# EAGLE design Audio Amplifier (EAGLE 9.1.2)
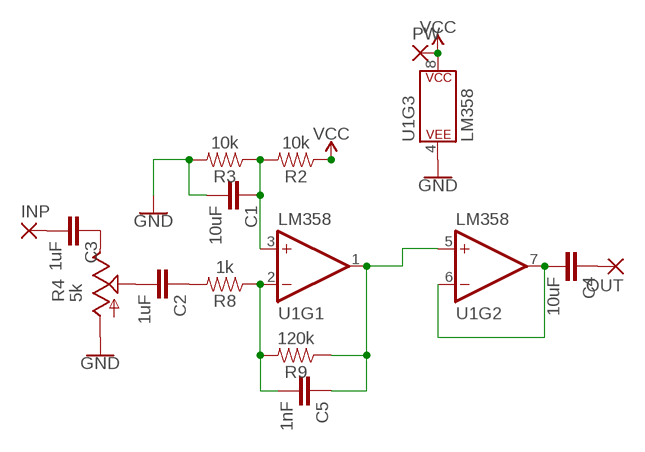
[diagram p0: schematic, sheet 1]

## Parts
C1  10uF  C5/3.5  [C5B3.5]
C2  1uF  C5/3.5  [C5B3.5]
C3  1uF  C5/3.5  [C5B3.5]
C4  10uF  C5/3.5  [C5B3.5]
C5  1nF  C5/3.5  [C5B3.5]
INP  2,54/1,1  [2,54/1,1]
OUT  2,54/1,1  [2,54/1,1]
PW  2,54/1,1  [2,54/1,1]
R2  10k  1KOHM-HORIZ-1/4W-1%  [AXIAL-0.3]
R3  10k  1KOHM-HORIZ-1/4W-1%  [AXIAL-0.3]
R4  5k  TRIM_US-B25V  [B25V]
R8  1k  1KOHM-HORIZ-1/4W-1%  [AXIAL-0.3]
R9  120k  1KOHM-HORIZ-1/4W-1%  [AXIAL-0.3]
U1  LM358  [DIP08]

## Nets
GND: C1.2 R3.P$2 R4.A U1.4(P$V-)
N$1: C1.1 R2.P$2 R3.P$1 U1.3(+IN)
N$2: C2.1 R8.P$2
N$3: C4.2 U1.6(-IN) U1.7(OUT)
N$4: C2.2 R4.S
N$5: C3.1 R4.E
N$6: C3.2 INP.1(P)
N$7: C5.2 R8.P$1 R9.P$2 U1.2(-IN)
N$9: C4.1 OUT.1(P)
N$12: C5.1 R9.P$1 U1.1(OUT) U1.5(+IN)
VCC: PW.1(P) R2.P$1 U1.8(P$V+)

## Library data of the parts
C1-C5 = capacitor-wima:C: CAPACITOR naming: grid - package width
INP OUT PW = wirepad:2,54/1,1: THROUGH-HOLE PAD
R2 R3 R9 = SparkFun-Resistors:1KOHM: 1kΩ resistor A resistor is a passive two-terminal electrical component that implements electrical resistance as a circuit element. Resistors act to reduce current flow, and, at the same time, act to lower voltage levels within circuits. - Wikipedia; PROD_ID: RES-12182; VALUE: 1k
R4 = pot:TRIM_US-: POTENTIOMETER
R8 = SparkFun-Resistors:1KOHM: 1kΩ resistor A resistor is a passive two-terminal electrical component that implements electrical resistance as a circuit element. Resistors act to reduce current flow, and, at the same time, act to lower voltage levels within circuits. - Wikipedia; PROD_ID: RES-12182
U1 = SparkFun-IC-Amplifiers:LM358: LM358 Jellybean op-amp Datasheet <http://www.sparkfun.com/datasheets/Components/General/LM358.pdf> SparkFun Products Op-Amp (Thru-Hole) - LM358 <https://www.sparkfun.com/products/9456> (COM-09456); PROD_ID: IC-09172

## Net classes
0 default: width 0.762 mm, drill 0.762 mm, clearance 0.508 mm

## Board
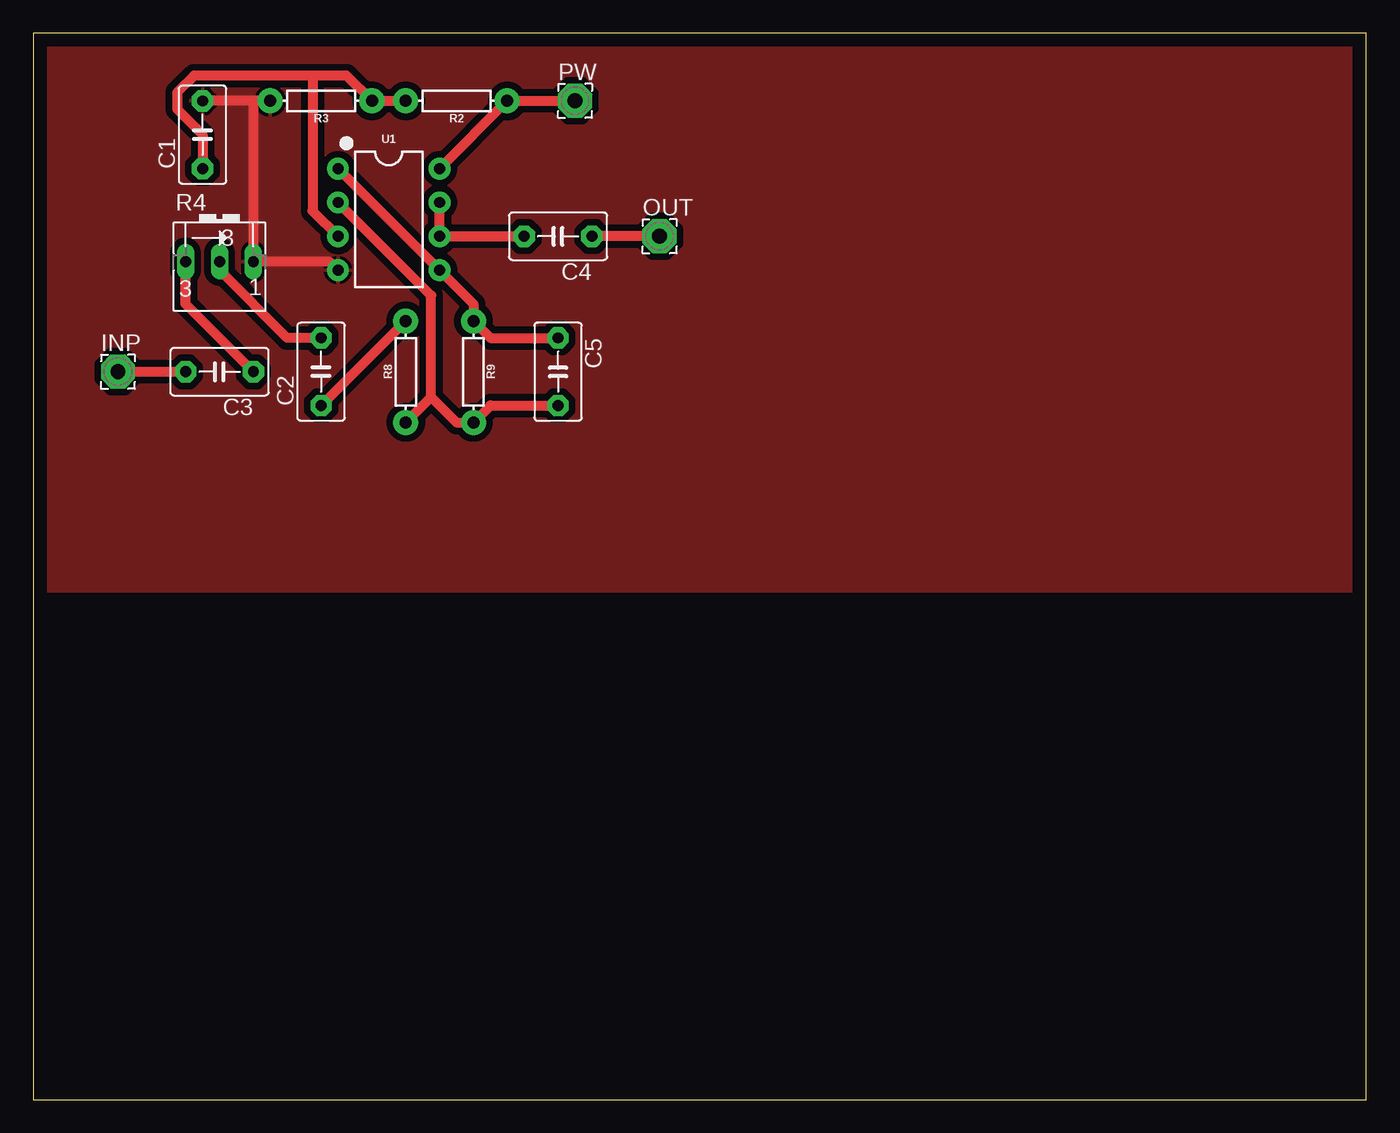
[diagram p1: board, top side]

Size 100 x 80 mm. Coordinates in mm from the lower left corner, seen from the top.
Outline: 0,0 100,0 100,80 0,80 0,0
Copper layers (1*16): Top 0.035mm / dielectric 1.5mm / Bottom 0.035mm
Design rules "default": minimum track width 6mil, minimum drill 0.35mm, track to track 6mil, track to pad 6mil, pad to pad 6mil, via to via 6mil, smd to smd 6mil, copper to edge 40mil, drill to drill 6mil, minimum pad ring 10mil, minimum via ring 8mil, stop-mask expansion 4mil, vias tented up to drill 0mil, thermal gap 10mil

### Footprints (pad centres in the part's own frame; a part is rotated, then mirrored left to right if it is on the bottom)
C5B3.5 = drill 0.813 pad 1.6 octagon: 1 -2.54,0; 2 2.54,0
2,54/1,1 = drill 1.118 pad 2.54 octagon: 1 0,0
AXIAL-0.3 = drill 0.9 pad 1.88: P$1 -3.81,0; P$2 3.81,0
B25V = drill 0.813 long: A 2.54,0.635; E -2.54,0.635; S 0,0.635
DIP08 = drill 0.813 pad 1.626: 1 -3.81,-3.81; 2 -1.27,-3.81; 3 1.27,-3.81; 4 3.81,-3.81; 5 3.81,3.81; 6 1.27,3.81; 7 -1.27,3.81; 8 -3.81,3.81

### Placement (x,y rotation side)
C1  12.7,72.39 90 top
C2  21.59,54.61 90 top
C3  13.97,54.61 180 top
C4  39.37,64.77 180 top
C5  39.37,54.61 270 top
INP  6.35,54.61 0 top
OUT  46.99,64.77 0 top
PW  40.64,74.93 0 top
R2  31.75,74.93 180 top
R3  21.59,74.93 180 top
R4  13.97,62.23 0 top
R8  27.94,54.61 90 top
R9  33.02,54.61 270 top
U1  26.67,66.04 270 top

### Tracks (layer width: path | path; a pad name or v marks a point on that pad's centre or on a via)
GND
  Top 0.762: U1.4 22.23,62.87 R4.A 16.51,74.93 | R3.P$2 16.51,74.93 | 16.51,74.93 C1.2
  pour Top: 0,80.01 100.33,80.01 100.33,38.1 0,38.1
N$1
  Top 0.762: C1.1 12.7,72.39 10.79,74.3 10.79,75.56 12.06,76.83 20.95,76.83 | 20.95,76.83 23.5,76.83 R3.P$1 R2.P$2 | U1.3 20.95,66.67 20.95,76.83
N$2
  Top 0.762: R8.P$2 C2.1
N$3
  Top 0.762: C4.2 U1.6 U1.7
N$4
  Top 0.762: R4.S 13.97,62.23 19.05,57.15 C2.2
N$5
  Top 0.762: R4.E 11.43,59.69 C3.1
N$6
  Top 0.762: INP.1 C3.2
N$7
  Top 0.762: C5.2 34.29,52.07 R9.P$2 31.75,50.8 29.84,52.7 | U1.2 29.84,60.33 29.84,52.7 | R8.P$1 29.84,52.7
N$9
  Top 0.762: OUT.1 C4.1
N$12
  Top 0.762: C5.1 34.29,57.15 R9.P$1 33.02,59.69 U1.5 U1.1
VCC
  Top 0.762: U1.8 R2.P$1 PW.1